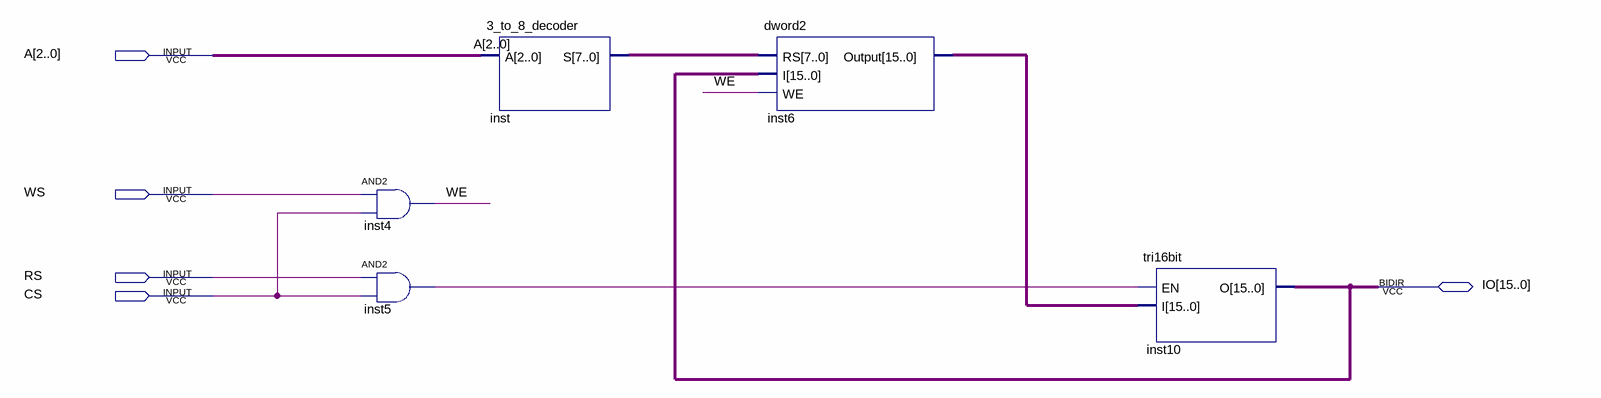
[diagram p0: schematic sheet]
// Quartus schematic DMem.bdf as structural Verilog: 5 symbols, 5 pins
module DMem (
  input  [2:0] A,
  input  WS,
  input  RS,
  input  CS,
  inout  [15:0] IO
);

  wire inst5_out, WE;
  wire [7:0] inst_s;
  wire [15:0] inst6_output;

  and inst4 (WE, WS, CS);
  and inst5 (inst5_out, RS, CS);
  \3_to_8_decoder  inst (.A(A), .S(inst_s));
  dword2 inst6 (.RS(inst_s), .I(IO), .WE(WE), .Output(inst6_output));
  tri16bit inst10 (.EN(inst5_out), .I(inst6_output), .O(IO));
endmodule
